# Altium schematic sheet Шаблон А0 Г Лист_1.SchDoc: Название изделия
size 1188 x 840 mm; ApprovedBy: Утвердил; CheckedBy: Проверил; Author: Разработал; CompanyName: Организация; Engineer: Нормоконтроль; Address1: Название изделия; Address2: Название изделия; DocumentNumber: Децимальный номер; SheetNumber: 1; SheetTotal: 1; Lit_1: У; Technologist: Технолог
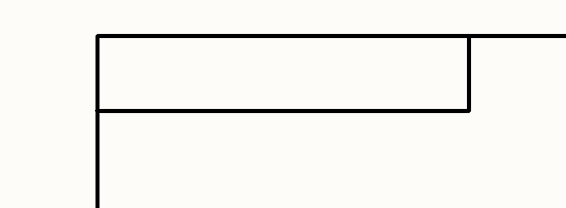
[diagram p0: Шаблон А0 Г Лист_1.SchDoc, top column 1 of 4]
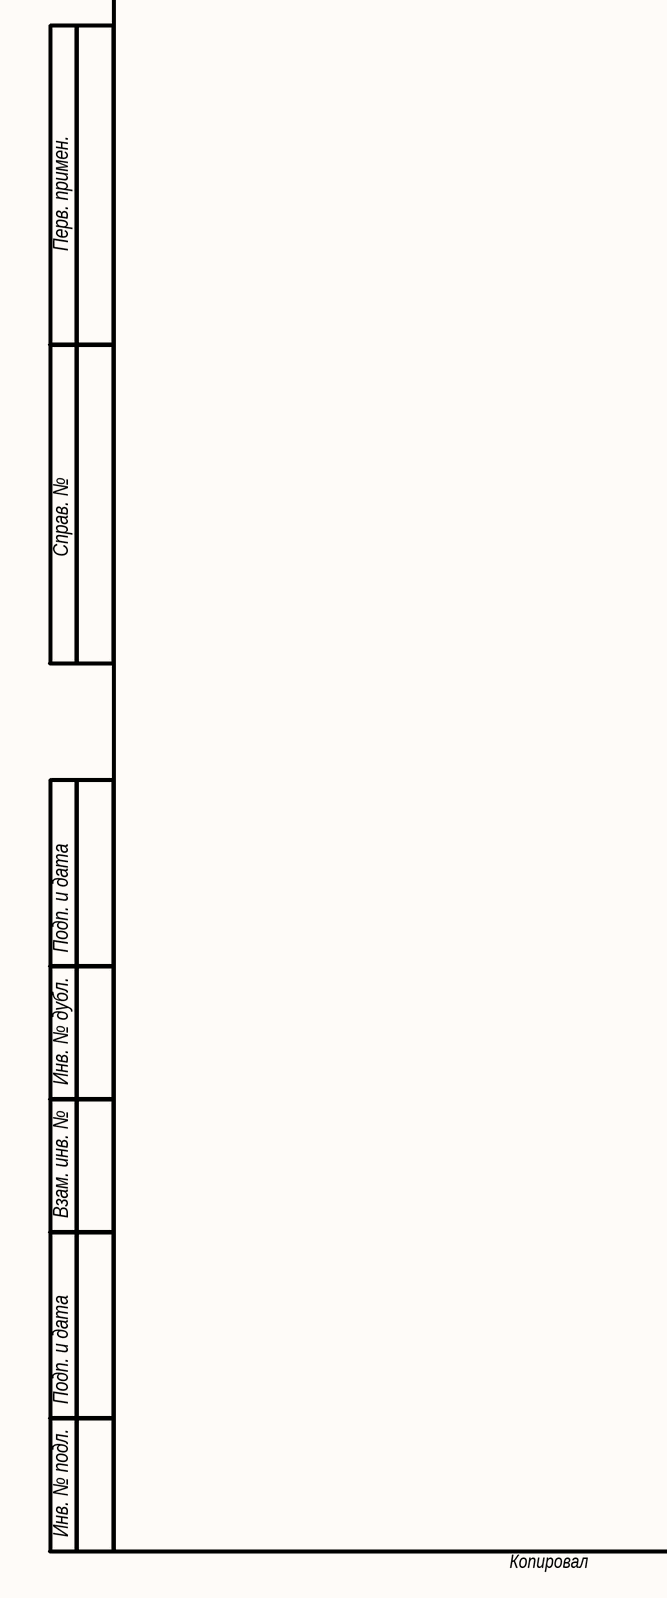
[diagram p1: Шаблон А0 Г Лист_1.SchDoc, bottom column 1 of 4]
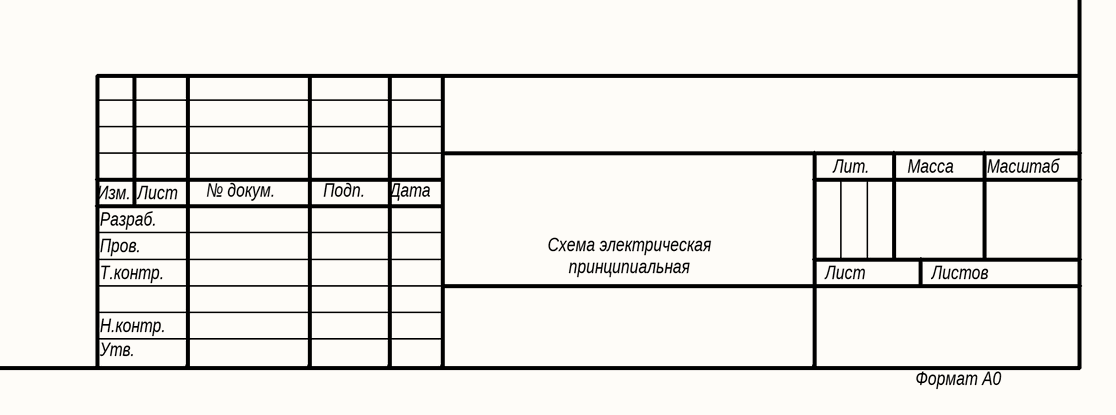
[diagram p2: Шаблон А0 Г Лист_1.SchDoc, bottom column 4 of 4]

## Notes on the sheet
- Перв. примен.
- Справ. №
- Подп. и дата
- Инв. № дубл.
- Взам. инв. №
- Изм.
- Разраб.
- Лист
- № докум.
- Подп.
- Дата
- Лит.
- Масса
- Масштаб
- Пров.
- Т.контр.
- Схема электрическая
  принципиальная
- Листов
- Инв. № подл.
- Н.контр.
- Утв.
- Копировал
- Формат А0